# Altium schematic sheet Otto 1.SchDoc
size B
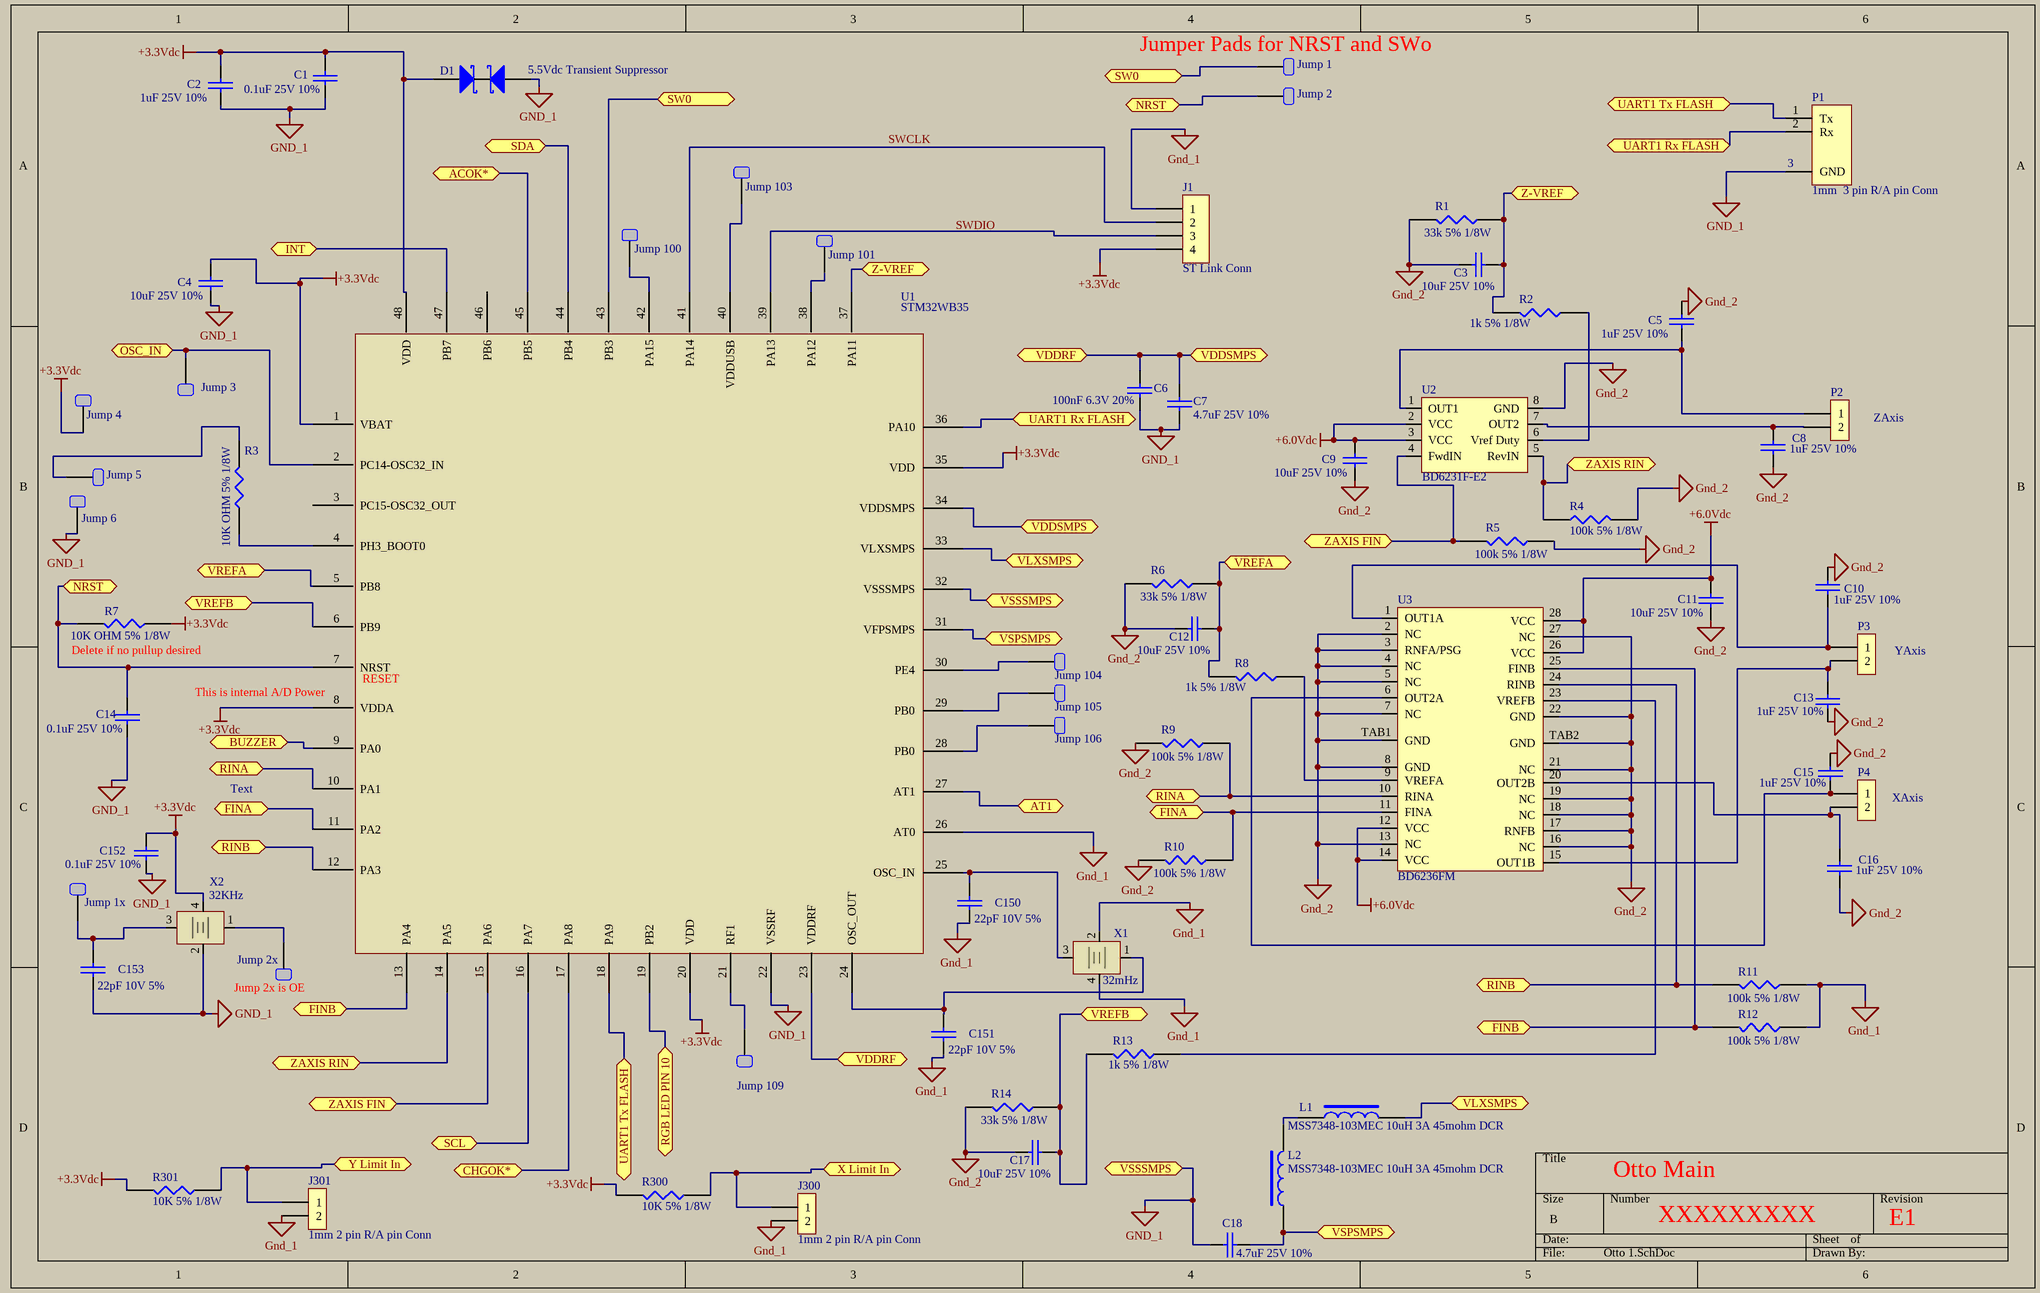
[diagram p0: Otto 1.SchDoc]

## Parts
C1  0.1uF 25V 10%  [0402]
C2  1uF 25V 10%  [0603]
C3  10uF 25V 10%  [BEADC3225X280N]
C4  10uF 25V 10%  [BEADC3225X280N]
C5  1uF 25V 10%  [0603]
C6  100nF 6.3V 20%  [0603]
C7  4.7uF 25V 10%  [0603]
C8  1uF 25V 10%  [0603]
C9  10uF 25V 10%  [BEADC3225X280N]
C10  1uF 25V 10%  [0603]
C11  10uF 25V 10%  [BEADC3225X280N]
C12  10uF 25V 10%  [BEADC3225X280N]
C13  1uF 25V 10%  [0603]
C14  0.1uF 25V 10%  [0402]
C15  1uF 25V 10%  [0603]
C16  1uF 25V 10%  [0603]
C17  10uF 25V 10%  [BEADC3225X280N]
C18  4.7uF 25V 10%  [0603]
C150  22pF 10V 5%  [0805]
C151  22pF 10V 5%  [0805]
C152  0.1uF 25V 10%  [0402]
C153  22pF 10V 5%  [0805]
D1  5.5Vdc Transient Suppressor  [TDK-TVS]
J1  ST Link Conn  [CONN-4]
J300  1mm 2 pin R/A pin Conn  [GTK-2]
J301  1mm 2 pin R/A pin Conn  [GTK-2]
Jump_1  Hook Up Terminal  [Pad]  (value not drawn)
Jump_1x  Hook Up Terminal  [Pad]  (value not drawn)
Jump_2  Hook Up Terminal  [Pad]  (value not drawn)
Jump_2x  Hook Up Terminal  [Pad]  (value not drawn)
Jump_3  Hook Up Terminal  [Pad]  (value not drawn)
Jump_4  Hook Up Terminal  [Pad]  (value not drawn)
Jump_5  Hook Up Terminal  [Pad]  (value not drawn)
Jump_6  Hook Up Terminal  [Pad]  (value not drawn)
Jump_100  Hook Up Terminal  [Pad]  (value not drawn)
Jump_101  Hook Up Terminal  [Pad]  (value not drawn)
Jump_103  Hook Up Terminal  [Pad]  (value not drawn)
Jump_104  Hook Up Terminal  [Pad]  (value not drawn)
Jump_105  Hook Up Terminal  [Pad]  (value not drawn)
Jump_106  Hook Up Terminal  [Pad]  (value not drawn)
Jump_109  Hook Up Terminal  [Pad]  (value not drawn)
L1  MSS7348-103MEC 10uH 3A 45mohm DCR  [Coilcraft 7x7 Inductor]
L2  MSS7348-103MEC 10uH 3A 45mohm DCR  [Coilcraft 7x7 Inductor]
P1  1mm  3 pin R/A pin Conn  [GTK 3pin 1mm Header]
P2  1mm 2 pin R/A pin Conn  [GTK-2]  (value not drawn)
P3  1mm 2 pin R/A pin Conn  [GTK-2]  (value not drawn)
P4  1mm 2 pin R/A pin Conn  [GTK-2]  (value not drawn)
R1  33k 5% 1/8W  [0805]
R2  1k 5% 1/8W  [0805]
R3  10K OHM 5% 1/8W  [0805]
R4  100k 5% 1/8W  [0805]
R5  100k 5% 1/8W  [0805]
R6  33k 5% 1/8W  [0805]
R7  10K OHM 5% 1/8W  [0805]
R8  1k 5% 1/8W  [0805]
R9  100k 5% 1/8W  [0805]
R10  100k 5% 1/8W  [0805]
R11  100k 5% 1/8W  [0805]
R12  100k 5% 1/8W  [0805]
R13  1k 5% 1/8W  [0805]
R14  33k 5% 1/8W  [0805]
R300  10K 5% 1/8W  [0805]
R301  10K 5% 1/8W  [0805]
U1  STM32WB35  [QFN50P700X700X65-49N-D]
U2  BD6231F-E2  [SOP-8]
U3  BD6236FM  [HSOP-M28]
X1  32mHz  [XTAL AND OSC]
X2  32KHz  [XTAL AND OSC]

## Ports
ACOK* (bidir), AT1 (bidir), BUZZER (bidir), CHGOK* (bidir), FINA (bidir), FINB (bidir), INT (bidir), NRST (bidir), OSC_IN (bidir), RGB LED PIN 10 (bidir), RINA (bidir), RINB (bidir), SCL (bidir), SDA (bidir), SW0 (bidir), UART1 Rx FLASH (bidir), UART1 Tx FLASH (bidir), VDDRF (bidir), VDDSMPS (bidir), VLXSMPS (bidir), VREFA (bidir), VREFB (bidir), VSPSMPS (bidir), VSSSMPS (bidir), X Limit In (bidir), Y Limit In (bidir), Z-VREF (bidir), ZAXIS FIN (bidir), ZAXIS RIN (bidir)

## Nets
+3.3Vdc: C1.1 C2.1 C4.1 C152.1 D1.1 J1.4 Jump_4.1 R7.2 R300.2 R301.2 U1.1(VBAT) U1.8(VDDA) U1.20(VDD) U1.35(VDD) U1.48(VDD) X2.4
+6.0Vdc: C9.1 C11.1 U2.2(VCC) U2.3(VCC) U3.12(VCC) U3.14(VCC) U3.26(VCC) U3.28(VCC)
Gnd_1: C1.2 C2.2 C4.2 C6.2 C7.1 C14.2 C18.1 C150.2 C151.2 C152.2 C153.2 D1.2 J1.1 J300.2 J301.2 Jump_6.1 P1.2(GND) R11.1 R12.1 U1.22(VSSRF) U1.26(AT0) U1.32(VSSSMPS) X1.2 X1.4 X2.2 ; port VSSSMPS
Gnd_2: C3.1 C5.1 C8.2 C9.2 C10.1 C11.2 C12.1 C13.2 C15.1 C16.2 C17.1 R1.2 R4.2 R5.1 R6.2 R9.2 R10.2 R14.2 U2.8(GND) U3.2(NC) U3.3(RNFA/PSG) U3.4(NC) U3.5(NC) U3.7(NC) U3.8(GND) U3.13(NC) U3.16(NC) U3.17(RNFB) U3.18(NC) U3.19(NC) U3.21(NC) U3.22(GND) U3.27(NC) U3.TAB1(GND) U3.TAB2(GND)
ACOK*: U1.45(PB5) ; port ACOK*
AT1: U1.27(AT1) ; port AT1
BUZZER: U1.9(PA0) ; port BUZZER
CHGOK*: U1.17(PA8) ; port CHGOK*
FINA: R10.1 U1.11(PA2) U3.11(FINA) ; port FINA
FINB: R12.2 U1.13(PA4) U3.25(FINB) ; port FINB
INT: U1.47(PB7) ; port INT
NRST: C14.1 Jump_2.1 R7.1 U1.7(NRST) ; port NRST
OSC_IN: Jump_3.1 U1.2(PC14-OSC32_IN) ; port OSC_IN
RGB LED PIN 10: U1.19(PB2) ; port RGB LED PIN 10
RINA: R9.1 U1.10(PA1) U3.10(RINA) ; port RINA
RINB: R11.2 U1.12(PA3) U3.24(RINB) ; port RINB
SCL: U1.16(PA7) ; port SCL
SDA: U1.44(PB4) ; port SDA
SW0: Jump_1.1 U1.43(PB3) ; port SW0
SWCLK: J1.2 U1.41(PA14)
UART1 Rx FLASH: P1.2(Rx) U1.36(PA10) ; port UART1 Rx FLASH
UART1 Tx FLASH: P1.1(Tx) U1.18(PA9) ; port UART1 Tx FLASH
VDDRF: C6.1 C7.2 U1.23(VDDRF) U1.34(VDDSMPS) ; port VDDSMPS, port VDDRF
VLXSMPS: L1.2 U1.33(VLXSMPS) ; port VLXSMPS
VREFA: C12.2 R6.1 R8.2 U1.5(PB8) ; port VREFA
VREFB: C17.2 R13.2 R14.1 U1.6(PB9) ; port VREFB
VSPSMPS: C18.2 L2.1 U1.31(VFPSMPS) ; port VSPSMPS
X Limit In: J300.1 R300.1 ; port X Limit In
Y Limit In: J301.1 R301.1 ; port Y Limit In
Z-VREF: C3.2 R1.1 R2.2 U1.37(PA11) ; port Z-VREF
ZAXIS FIN: R5.2 U1.15(PA6) U2.4(FwdIN) ; port ZAXIS FIN
ZAXIS RIN: R4.1 U1.14(PA5) U2.5(RevIN) ; port ZAXIS RIN
NetC5_2: C5.2 P2.1 U2.1(OUT1)
NetC8_1: C8.1 P2.2 U2.7(OUT2)
NetC10_2: C10.2 P3.1 U3.1(OUT1A)
NetC13_1: C13.1 P3.2 U3.15(OUT1B)
NetC15_2: C15.2 P4.1 U3.6(OUT2A)
NetC16_1: C16.1 P4.2 U3.20(OUT2B)
NetC150_1: C150.1 U1.25(OSC_IN) X1.3
NetC151_1: C151.1 U1.24(OSC_OUT) X1.1
NetC153_1: C153.1 Jump_1x.1 X2.3
NetJ1_3: J1.3 U1.39(PA13)
NetJump_2x_1: Jump_2x.1 X2.1
NetJump_5_1: Jump_5.1 R3.1
NetJump_100_1: Jump_100.1 U1.42(PA15)
NetJump_101_1: Jump_101.1 U1.38(PA12)
NetJump_103_1: Jump_103.1 U1.40(VDDUSB)
NetJump_104_1: Jump_104.1 U1.30(PE4)
NetJump_105_1: Jump_105.1 U1.29(PB0)
NetJump_106_1: Jump_106.1 U1.28(PB0)
NetJump_109_1: Jump_109.1 U1.21(RF1)
NetL1_1: L1.1 L2.2
NetR2_1: R2.1 U2.6(Vref_Duty)
NetR3_2: R3.2 U1.4(PH3_BOOT0)
NetR8_1: R8.1 U3.9(VREFA)
NetR13_1: R13.1 U3.23(VREFB)

Not connected (* = marked no-connect by the designer): U1 3(PC15-OSC32_OUT) 46(PB6)

## Notes on the sheet
- (near Jump_1) Jumper Pads for NRST and SWo
- (near P1) 3
- (near P2) ZAxis
- (near R7) Delete if no pullup desired
- (near U1) This is internal A/D Power
- (near U1) RESET
- (near P3) YAxis
- Text
- (near P4) XAxis
- (near Jump_2x) Jump 2x is OE
- Otto Main
- XXXXXXXXX
- E1
- Labels drawn without touching a wire or pin: SWDIO

## Library data of the parts
C1 C14 C152 = CAP: TMK105BJ104KV8F Taiyo Uden 0.1uF 25V 10% 2.3 cents at Mouser
C2 C5 C8 C10 C13 C15 C16 = CAP: CC0603KRX5R8BB105 1uf 25V 10% Yageo 3 cents at Mouser
C3 C4 C9 C11 C12 C17 = CAP: CC1210KFX7R8BB106 Yageo 10uF 25V 10% 23 cents at Mouser
C6 = CAP: 06036C104MAZ2A Kyocera 100nf 6.3V 20% 12 cents at Mouser
C7 C18 = CAP: GRM188R61E475KE11D Murata 4.7uF 25V 10% 7.9 centsat Mouser
C150 C151 C153 = CAP: C0805C220J8GACAUTO Kemet 0805 22pF 5% 7 cents at Mouser
D1 = X1-DFN1006-2: B74111U0055M060  TDK 5.5vdc Supressor 3cents at Mouser
J1 = CON4: Standard 0.1in center terminal strip
J300 J301 = 2 PIN .1mm GTK Receptacle_1: WTBI-02S-CF3-R 5 pin R-A 1mm center GTK Receptacle
L1 L2 = INDUCTOR2: MSS7348-103MEC Coilcraft 10uH 3A 45mohm DCR 80cents at Mouser
P1 = UART Xcvr Conn: GTK WTBI-03S-SMH1T-R3 pin R-A 1mm center GTK Header
P2 P4 = 2 PIN .1mm GTK Header: WTBI-02S-SMH1T-R 2pin R-A 1mm center GTK Header
P3 = 2 PIN .1mm GTK Header: WTBI-02S-SMH1T-R  2pin R-A 1mm center GTK Header
R1 R6 R14 = RES1: CR0805-JW-333ELF Bourns 33k 5% .125 4 cents at Mouser
R2 R8 R13 = RES1: CR0805-JW-102ELF Bourns1k 5% .125A 0.5centsat Mouser
R3 R7 R300 R301 = RES1: CRCW080510K0JNEAC  5% .125 .8cents at Mouser
R4 = RES1: CRCW0805100KJNEAC Vishay 100k .125 5% 1.6 cents at Digikey
R5 R9-R12 = RES1: need mew pn --- 0805FR-07150RL (Yageo)
U1 = STM32: STM32WB35CEU6ATR
U2 = BD6231F-E2: BD6231F-E2 Rohm DC Brush Mtr Driver 1.52 at Mouser
U3 = BD6236FM: BD6236FM-E2 DC Brush Mtr Driver 2 CH Rohm 4.34 at Digikey
X1 = XTAL: ECS-320-12-37B-7KM-TR3   Crystal 12 pF ECX-1637B 7/10ppm  35 crnts at Mouser
X2 = XTAL: Pericom 3270004 32KhZ